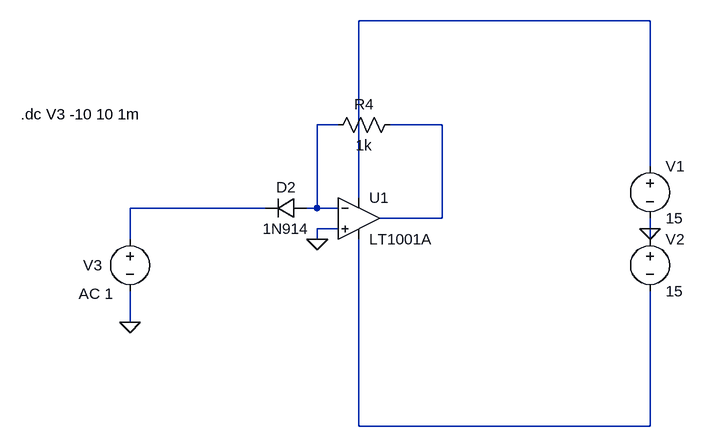
[diagram p0: schematic ExponentialAmp.asc]
ExponentialAmp.asc, the LTspice schematic file:
Version 4
SHEET 1 880 680
WIRE 768 -192 320 -192
WIRE 288 -32 256 -32
WIRE 448 -32 368 -32
WIRE 768 32 768 -192
WIRE 320 80 320 -192
WIRE 176 96 -32 96
WIRE 256 96 256 -32
WIRE 256 96 240 96
WIRE 288 96 256 96
WIRE 448 112 448 -32
WIRE 448 112 352 112
WIRE 288 128 256 128
WIRE 768 128 768 112
WIRE -32 144 -32 96
WIRE 256 144 256 128
WIRE 768 144 768 128
WIRE -32 272 -32 224
WIRE 320 432 320 144
WIRE 768 432 768 224
WIRE 768 432 320 432
FLAG -32 272 0
FLAG 768 128 0
FLAG 256 144 0
SYMBOL voltage 768 16 R0
WINDOW 123 0 0 Left 2
WINDOW 39 0 0 Left 2
SYMATTR InstName V1
SYMATTR Value 15
SYMBOL voltage 768 128 R0
WINDOW 123 0 0 Left 2
WINDOW 39 0 0 Left 2
SYMATTR InstName V2
SYMATTR Value 15
SYMBOL Opamps\\LT1001A 320 48 R0
SYMATTR InstName U1
SYMBOL voltage -32 128 R0
WINDOW 0 -72 56 Left 2
WINDOW 3 -301 -26 Invisible 2
WINDOW 123 -79 100 Left 2
WINDOW 39 0 0 Left 2
SYMATTR InstName V3
SYMATTR Value 1
SYMATTR Value2 AC 1
SYMBOL res 384 -48 R90
WINDOW 0 0 56 VBottom 2
WINDOW 3 32 56 VTop 2
SYMATTR InstName R4
SYMATTR Value 1k
SYMBOL diode 240 80 R90
WINDOW 0 0 32 VBottom 2
WINDOW 3 32 32 VTop 2
SYMATTR InstName D2
SYMATTR Value 1N914
TEXT -200 -48 Left 2 !.dc V3 -10 10 1m

The netlist it stands for:
* ExponentialAmp.asc
V1 N001 0 15
V2 0 N005 15
XU1 0 N002 N001 N005 N003 LT1001  ; LT1001A, pins In+ In- V+ V- OUT
V3 N004 0 1 AC 1
R4 N003 N002 1k
D2 N002 N004 1N914
.model D D
.lib standard.dio
.dc V3 -10 10 1m
.lib LTC.lib
.backanno
.end